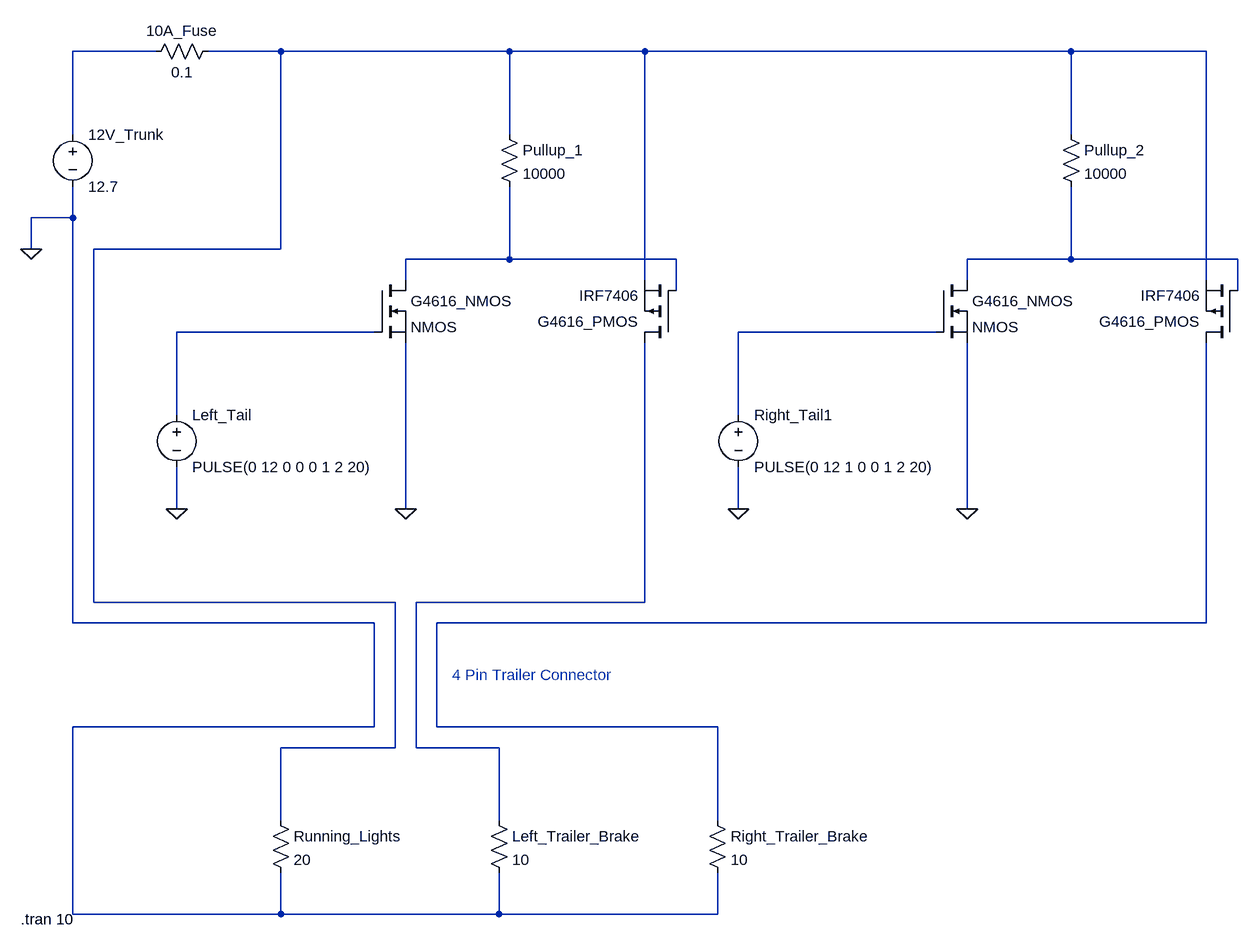
[diagram p0: schematic TrailerLights.asc]
TrailerLights.asc, the LTspice schematic file:
Version 4
SHEET 1 2884 1172
WIRE 832 -256 704 -256
WIRE 1024 -256 912 -256
WIRE 1376 -256 1024 -256
WIRE 1584 -256 1376 -256
WIRE 2240 -256 1584 -256
WIRE 2448 -256 2240 -256
WIRE 704 -128 704 -256
WIRE 1376 -128 1376 -256
WIRE 2240 -128 2240 -256
WIRE 704 0 704 -48
WIRE 704 0 640 0
WIRE 640 48 640 0
WIRE 1024 48 1024 -256
WIRE 1024 48 736 48
WIRE 1376 64 1376 -48
WIRE 1376 64 1216 64
WIRE 1632 64 1376 64
WIRE 2240 64 2240 -48
WIRE 2240 64 2080 64
WIRE 2496 64 2240 64
WIRE 1216 96 1216 64
WIRE 1584 96 1584 -256
WIRE 2080 96 2080 64
WIRE 2448 96 2448 -256
WIRE 1632 112 1632 64
WIRE 2496 112 2496 64
WIRE 1168 176 864 176
WIRE 2032 176 1728 176
WIRE 864 304 864 176
WIRE 1728 304 1728 176
WIRE 864 448 864 384
WIRE 1216 448 1216 192
WIRE 1728 448 1728 384
WIRE 2080 448 2080 192
WIRE 736 592 736 48
WIRE 1200 592 736 592
WIRE 1584 592 1584 192
WIRE 1584 592 1232 592
WIRE 704 624 704 0
WIRE 1168 624 704 624
WIRE 2448 624 2448 192
WIRE 2448 624 1264 624
WIRE 1168 784 1168 624
WIRE 1168 784 704 784
WIRE 1264 784 1264 624
WIRE 1696 784 1264 784
WIRE 1200 816 1200 592
WIRE 1200 816 1024 816
WIRE 1232 816 1232 592
WIRE 1360 816 1232 816
WIRE 1024 928 1024 816
WIRE 1360 928 1360 816
WIRE 1696 928 1696 784
WIRE 704 1072 704 784
WIRE 1024 1072 1024 1008
WIRE 1024 1072 704 1072
WIRE 1360 1072 1360 1008
WIRE 1360 1072 1024 1072
WIRE 1696 1072 1696 1008
WIRE 1696 1072 1360 1072
FLAG 864 448 0
FLAG 1216 448 0
FLAG 1728 448 0
FLAG 2080 448 0
FLAG 640 48 0
SYMBOL voltage 704 -144 R0
WINDOW 123 0 0 Left 0
WINDOW 39 0 0 Left 0
SYMATTR InstName 12V_Trunk
SYMATTR Value 12.7
SYMBOL voltage 864 288 R0
WINDOW 123 0 0 Left 0
WINDOW 39 0 0 Left 0
SYMATTR InstName Left_Tail
SYMATTR Value PULSE(0 12 0 0 0 1 2 20)
SYMBOL res 1344 912 R0
SYMATTR InstName Left_Trailer_Brake
SYMATTR Value 10
SYMBOL pmos 1632 192 R180
SYMATTR InstName G4616_PMOS
SYMATTR Value IRF7406
SYMBOL nmos 1168 96 R0
SYMATTR InstName G4616_NMOS
SYMBOL res 1360 -144 R0
SYMATTR InstName Pullup_1
SYMATTR Value 10000
SYMBOL voltage 1728 288 R0
WINDOW 123 0 0 Left 0
WINDOW 39 0 0 Left 0
SYMATTR InstName Right_Tail1
SYMATTR Value PULSE(0 12 1 0 0 1 2 20)
SYMBOL res 1680 912 R0
SYMATTR InstName Right_Trailer_Brake
SYMATTR Value 10
SYMBOL pmos 2496 192 R180
SYMATTR InstName G4616_PMOS
SYMATTR Value IRF7406
SYMBOL nmos 2032 96 R0
SYMATTR InstName G4616_NMOS
SYMBOL res 2224 -144 R0
SYMATTR InstName Pullup_2
SYMATTR Value 10000
SYMBOL res 928 -272 R90
WINDOW 0 0 56 VBottom 2
WINDOW 3 32 56 VTop 2
SYMATTR InstName 10A_Fuse
SYMATTR Value 0.1
SYMBOL res 1008 912 R0
SYMATTR InstName Running_Lights
SYMATTR Value 20
TEXT 1288 704 Left 2 ;4 Pin Trailer Connector
TEXT 624 1080 Left 2 !.tran 10

The netlist it stands for:
* TrailerLights.asc
V§12V_Trunk N001 0 12.7
V§Left_Tail N005 0 PULSE(0 12 0 0 0 1 2 20)
R§Left_Trailer_Brake N007 0 10
M§G4616_PMOS N007 N003 N002 N002 IRF7406
M§G4616_NMOS N003 N005 0 0 NMOS
R§Pullup_1 N002 N003 10000
V§Right_Tail1 N006 0 PULSE(0 12 1 0 0 1 2 20)
Right_Trailer_Brake N008 0 10
M§G4616_PMOS N008 N004 N002 N002 IRF7406
M§G4616_NMOS N004 N006 0 0 NMOS
R§Pullup_2 N002 N004 10000
R§10A_Fuse N002 N001 0.1
Running_Lights N002 0 20
.model NMOS NMOS
.model PMOS PMOS
.lib standard.mos
* 4 Pin Trailer Connector
.tran 10
.backanno
.end